# Altium schematic sheet 2  - Power Switch.SchDoc
size A4
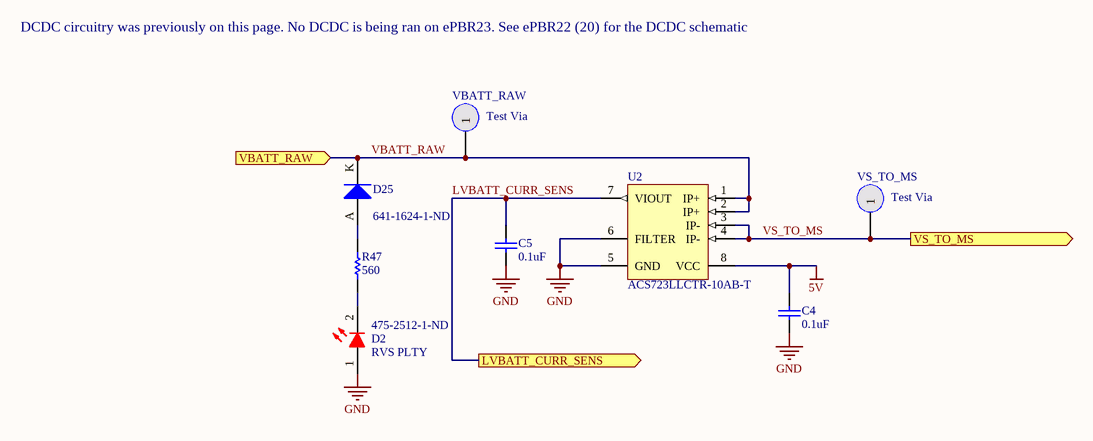
[diagram p0: 2  - Power Switch.SchDoc]

## Parts
C4  value 0.1uF  [1608[0603]]  (hidden comment: Cap Semi)
C5  value 0.1uF  [1608[0603]]  (hidden comment: Cap Semi)
D2  RVS PLTY  Supplier Part Number 1: 475-2512-1-ND  [TOSH-0603LED_RED_V]
D25  Supplier Part Number 1: 641-1624-1-ND  [SOD-123]
R47  560  [RESC0603(1608)_L]
U2  ACS723LLCTR-10AB-T  [ALEG-LC-8_V]
VBATT_RAW  Test Via  [Test Via]
VS_TO_MS  Test Via  [Test Via]

## Ports
LVBATT_CURR_SENS (out), VBATT_RAW (in), VS_TO_MS (out)

## Nets
5V: C4.2 U2.8(VCC)
GND: C4.1 C5.1 D2.1(A) U2.5(GND) U2.6(FILTER)
LVBATT_CURR_SENS: C5.2 U2.7(VIOUT) ; port LVBATT_CURR_SENS
VBATT_RAW: D25.K U2.1(IP+) U2.2(IP+) VBATT_RAW.1 ; port VBATT_RAW
VS_TO_MS: U2.3(IP-) U2.4(IP-) VS_TO_MS.1 ; port VS_TO_MS
NetD2_2: D2.2(K) R47.1
NetD25_A: D25.A R47.2

## Notes on the sheet
- DCDC circuitry was previously on this page. No DCDC is being ran on ePBR23. See ePBR22 (20) for the DCDC schematic

## Library data of the parts
C4 C5 = Cap Semi: Capacitor (Semiconductor SIM Model); Published: 8-Jun-2000; LatestRevisionDate: 29-May-2009; LatestRevisionNote: IPC-7351 Footprint Added.; PackageReference: C1206; Publisher: Altium Limited; PackageDescription: Chip Capacitor; Supplier 1: Digi-Key; Supplier 2: Digi-Key; Supplier Part Number 2: 490-14359-1-ND
D2 = CMP-0444-00001-1: LED, Red 0603 (1608) 63mCd; Manufacturer: Toshiba; PartNumber: TLSU1008A(T04); Forward Current: 25 mA; Power Dissipation: 60 mW; Packing Type: Reel; Reverse Voltage: 4 V; Mounting Technology: Surface Mount; PackageDescription: 2-Pin SMT LED, 1.6 x 0.8 mm Pitch; ComponentLink1URL: http://www.toshiba-components.com/; ComponentLink1Description: Manufacturer URL; PackageReference: 0603LED_RED; ComponentLink2URL: http://www.semicon.toshiba.co.jp/info/docget.jsp?type=datasheet&lang=en&pid=TLSU1008A(T04); ComponentLink2Description: Datasheet; DatasheetVersion: Aug-08; Storage Temperature: -40 to 100 degC; Supplier 1: Digi-Key
D25 = Diode 1N4003: 1 Amp General Purpose Rectifier; Published: 8-Jun-2000; LatestRevisionDate: 17-Jul-2002; LatestRevisionNote: Re-released for DXP Platform.; DatasheetVersion: 1998; PackageVersion: Aug-1999; PackageReference: DO-41; Publisher: Altium Limited; PackageDescription: Diode, Axial; Body 5.2 x 2.7 mm (LxDia. max), Lead Dia. 0.86 mm (max); Code_JEDEC: DO-204-AL; ComponentLink1Description: Manufacturer Link; ComponentLink1URL: http://www.fairchildsemi.com/; ComponentLink2Description: Datasheet; ComponentLink2URL: http://www.fairchildsemi.com/ds/1N%2F1N4001.pdf; Supplier 1: Digi-Key
R47 = CMP-1591-00001-1: 0603 (1608 Metric) Chip Resistor; Case-Metric: 1608; Case-EIA: 0603; PackageReference: RESC0603(1608); Supplier 1: Digi-Key; Supplier Part Number 1: P430BZCT-ND
U2 = CMP-0826-00001-1: Linear Current Sensor IC, 4.5 to 5.5 V Supply Voltage, 10 mA Supply Current, -40 to 85 degC, 8-Pin SOIC (LC), RoHS, Tape and Reel; Manufacturer: Allegro Microsystems; PartNumber: ACS712ELCTR-20A-T; CLOAD: 10 nF Max.; ICC: 10 mA; F: 80 kHz; RLOAD: 4.7 kOhm Min.; Optimized Accuracy Range: +/- 20 A; TR: 3.5 us; Sensitivity Sens: 100 mV/A Typ.; Operating Temperature Range: -40 to 85 degC; ComponentLink2URL: http://www.allegromicro.com/~/media/Files/Datasheets/ACS712-Datasheet.ashx; ComponentLink1Description: Manufacturer URL; VCC: 4.5 to 5.5 V; Mounting Technology: Surface Mount; DatasheetVersion: Rev. 15; ComponentLink2Description: Datasheet; ComponentLink1URL: http://www.allegromicro.com/; PackageDescription: 8-Pin SOIC, Body 4.9 x 3.9 mm, Pitch 1.27 mm; PackageReference: LC-8; RoHS: TRUE; Packing: Tape and Reel; Supplier 1: Digi-Key; Supplier Part Number 1: 620-1190-1-ND